# Altium schematic sheet RWcircuit_2.SchDoc
size A4
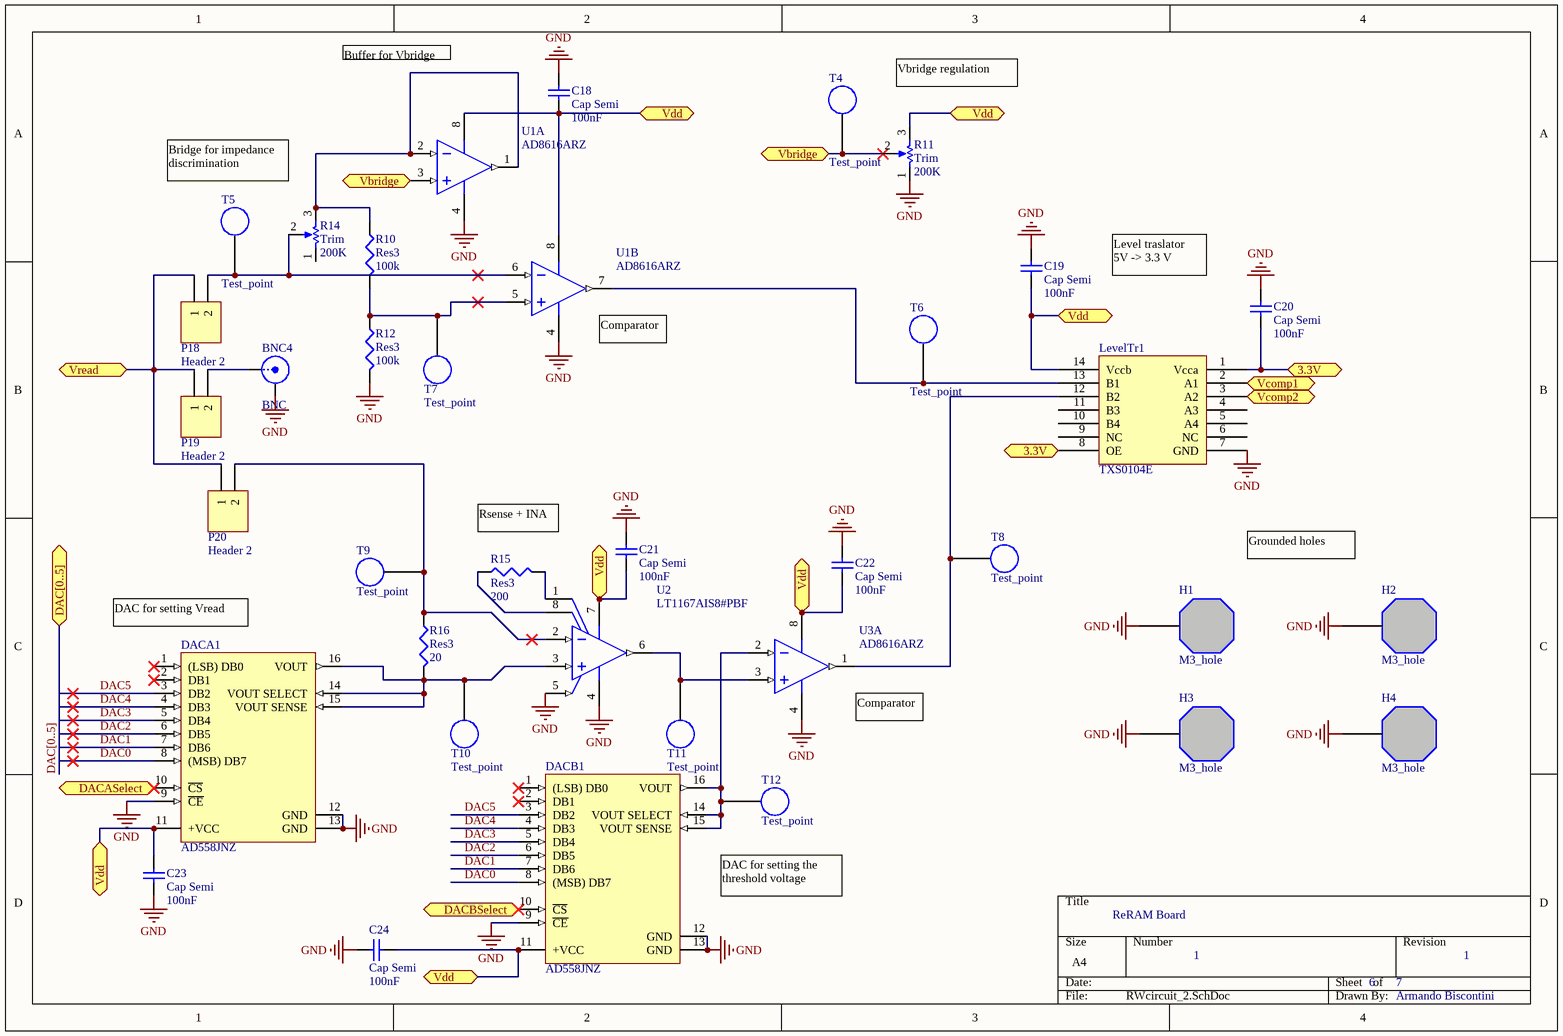
[diagram p0: RWcircuit_2.SchDoc]

## Parts
BNC4  BNC  [BNC_RA CON]
C18  Cap Semi  value 100nF  [C1206]
C19  Cap Semi  value 100nF  [C1206]
C20  Cap Semi  value 100nF  [C1206]
C21  Cap Semi  value 100nF  [C1206]
C22  Cap Semi  value 100nF  [C1206]
C23  Cap Semi  value 100nF  [C1206]
C24  Cap Semi  value 100nF  [C1206]
DACA1  AD558JNZ  [N-16]
DACB1  AD558JNZ  [N-16]
H1  M3_hole  [M3_hole]
H2  M3_hole  [M3_hole]
H3  M3_hole  [M3_hole]
H4  M3_hole  [M3_hole]
LevelTr1  TXS0104E  [SOIC127P600X175-14N]
P18  Header 2  [HDR1X2]
P19  Header 2  [HDR1X2]
P20  Header 2  [HDR1X2]
R10  Res3  value 100k  [J1-0603]
R11  Trim  value 200K  [Trim_Bourns_3266W]
R12  Res3  value 100k  [J1-0603]
R14  Trim  value 200K  [Trim_Bourns_3266W]
R15  Res3  value 200  [J1-0603]
R16  Res3  value 20  [J1-0603]
T4  Test_point  [Test_point_1.32mm]
T5  Test_point  [Test_point_1.32mm]
T6  Test_point  [Test_point_1.32mm]
T7  Test_point  [Test_point_1.32mm]
T8  Test_point  [Test_point_1.32mm]
T9  Test_point  [Test_point_1.32mm]
T10  Test_point  [Test_point_1.32mm]
T11  Test_point  [Test_point_1.32mm]
T12  Test_point  [Test_point_1.32mm]
U1  AD8616ARZ  [ADI-R-8_N]  (parts A,B of 2)
U2  LT1167AIS8#PBF  [LT-S8-8_N]
U3  AD8616ARZ  [ADI-R-8_N]  (part A of 2)

## Ports
3.3V, DAC[0..5], DACASelect, DACBSelect, Vbridge, Vcomp1, Vcomp2, Vdd, Vread

## Nets
GND: BNC4.2(Y) C18.1 C19.1 C20.1 C21.2 C22.1 C23.2 C24.1 DACA1.9(~{CE}) DACA1.12(GND) DACA1.13(GND) DACB1.9(~{CE}) DACB1.12(GND) DACB1.13(GND) H1.1 H2.1 H3.1 H4.1 LevelTr1.7(GND) R11.1(TOP) R12.1 U1.4(-V) U2.4(-VS) U2.5(REF) U3.4(-V)
3.3V: C20.2 LevelTr1.1(Vcca) LevelTr1.8(OE) ; port 3.3V
DAC0: DACA1.8((MSB)_DB7) DACB1.8((MSB)_DB7)
DAC1: DACA1.7(DB6) DACB1.7(DB6)
DAC2: DACA1.6(DB5) DACB1.6(DB5)
DAC3: DACA1.5(DB4) DACB1.5(DB4)
DAC4: DACA1.4(DB3) DACB1.4(DB3)
DAC5: DACA1.3(DB2) DACB1.3(DB2)
DACASelect: DACA1.10(~{CS}) ; port DACASelect
DACBSelect: DACB1.10(~{CS}) ; port DACBSelect
Vbridge: R11.2(TAP) T4.1 U1.3(+IN_A) ; port Vbridge
Vcomp1: LevelTr1.2(A1) ; port Vcomp1
Vcomp2: LevelTr1.3(A2) ; port Vcomp2
Vdd: C18.2 C19.2 C21.1 C22.2 C23.1 C24.2 DACA1.11(+VCC) DACB1.11(+VCC) LevelTr1.14(Vccb) R11.3(BOT) U1.8(+V) U2.7(+VS) U3.8(+V) ; port Vdd
Vread: P18.1 P19.1 P20.1 ; port Vread
NetBNC4_1: BNC4.1(X) P19.2
NetDACA1_14: DACA1.14(VOUT_SELECT) DACA1.15(VOUT_SENSE) DACA1.16(VOUT) R16.1 T10.1 U2.3(+IN)
NetDACB1_14: DACB1.14(VOUT_SELECT) DACB1.15(VOUT_SENSE) DACB1.16(VOUT) T12.1 U3.2(-IN_A)
NetLevelTr1_12: LevelTr1.12(B2) T8.1 U3.1(OUT_A)
NetLevelTr1_13: LevelTr1.13(B1) T6.1 U1.7(OUT_B)
NetP18_2: P18.2 R14.2(TAP) T5.1 U1.6(-IN_B)
NetP20_2: P20.2 R16.2 T9.1 U2.2(-IN)
NetR10_1: R10.1 R12.2 T7.1 U1.5(+IN_B)
NetR10_2: R10.2 R14.3(BOT) U1.1(OUT_A) U1.2(-IN_A)
NetR15_1: R15.1 U2.1(RG)
NetR15_2: R15.2 U2.8(RG)
NetT11_1: T11.1 U2.6(OUTPUT) U3.3(+IN_A)

Not connected (* = marked no-connect by the designer): DACA1 1((LSB)_DB0)* 2(DB1)*; DACB1 1((LSB)_DB0)* 2(DB1)*; LevelTr1 4(A3) 5(A4) 6(NC) 9(NC) 10(B4) 11(B3); R14 1(TOP)

## Buses and harness runs
bus DAC[0..5] = port DAC[0..5]

## Notes on the sheet
- Buffer for Vbridge
- Vbridge regulation
- Bridge for impedance discrimination
- Level traslator
  5V -> 3.3 V
- (near U1) Comparator
- (near R15) Rsense + INA
- Grounded holes
- (near DACA1) DAC for setting Vread
- (near U3) Comparator
- DAC for setting the threshold voltage
- ReRAM Board
- 1
- 6
- 7
- Armando Biscontini

## Library data of the parts
BNC4 = BNC: BNC Elbow Connector; LatestRevisionDate: 17-Jul-2002; LatestRevisionNote: Re-released for DXP Platform.; Publisher: Altium Limited
C18-C24 = Cap Semi: Capacitor (Semiconductor SIM Model); Published: 8-Jun-2000; LatestRevisionDate: 29-May-2009; LatestRevisionNote: IPC-7351 Footprint Added.; PackageReference: C1206; Publisher: Altium Limited; PackageDescription: Chip Capacitor
DACA1 DACB1 = AD558JNZ: Single 8-Bit Low Cost Complete uP-Compatible DACPORT, 0 to +70 degC, N-16, Pb-Free, Tube; Generic Part Number: AD558; Manufacturer: Analog Devices; # DAC Outputs: 1; Max V+: 16.5V; Op Pwr Diss: 375mW; Resolution (Bits): 8; Settling Time: 800ns; Single Supply: Yes; DatasheetVersion: Rev.A; PackageVersion: 070706-A; PackageReference: N-16; PackageDescription: 16-Lead Plastic Dual In-Line Package [PDIP] Narrow Body; Supplier 1: Digi-Key; Supplier Part Number 1: AD558JNZ-ND; Supplier 2: Farnell; Supplier Part Number 2: 1079362; Supplier 3: Farnell; Supplier Part Number 3: 1523778; Supplier 4: Newark; Supplier Part Number 4: 59K4249; Supplier 5: Mouser; Supplier Part Number 5: 584-AD558JNZ; Packing: Tube; RoHS: Y; Mounting Technology: Through Hole; Code_JEDEC: MS-001; PartNumber: AD558JNZ; ComponentLink1Description: Manufacturer URL; ComponentLink1URL: http://www.analog.com/en/index.html; ComponentLink2Description: Datasheet; ComponentLink2URL: http://www.analog.com/static/imported-files/data_sheets/AD558.pdf; ComponentLink3Description: Package Specification; ComponentLink3URL: http://www.analog.com/static/imported-files/packages/44768431550332N_16.pdf; ComponentLink4Description: Product URL; ComponentLink4URL: http://www.analog.com/en/digital-to-analog-converters/da-converters/ad558/products/product.html
H1-H4 = M3_hole: M3 hole
LevelTr1 = TXS0104E: Texas Instruments TXS0104E
P18-P20 = Header 2: Header, 2-Pin; LatestRevisionDate: 17-Jul-2002; LatestRevisionNote: Re-released for DXP Platform.; Publisher: Altium Limited
R10 R12 R15 R16 = Res3: Resistor; Published: 8-Jun-2000; LatestRevisionDate: 29-May-2009; LatestRevisionNote: IPC-7351 Footprint Added.; PackageReference: J1-0603; Publisher: Altium Limited; PackageDescription: Chip Resistor
R11 R14 = Trim_Bourns_3266W: Trimmer Bourns 3266W; Sim Note: Enter the Resistance value and the set point into parameter fields.; Set Position: 0.5; Published: 8-Jun-2000; LatestRevisionDate: 17-Jul-2002; LatestRevisionNote: Re-released for DXP Platform.; PackageReference: VR5; Publisher: Altium Limited; PackageDescription: Variable Resistor, Thru-Hole; 3 Leads
T4-T12 = Test_point_1.32mm: Test point 1.32mm
U1 U3 = AD8616ARZ: Double Channel Wide Bandwidth Operational Amplifier, 24 MHz BW, 12 V/us SR, Industrial, 8-pin SOIC (R-8), Tube; Generic Part Number: AD8616; Manufacturer: Analog Devices; Amplifiers Per Package: 2; Input Bias Current: 200fA; Input Offset Voltage: 23uV; Iq/Amp: 2mA; Slew Rate: 12V/us; Small Signal Bandwidth: 24MHz; V Span Max: 6V; V Span Min: 2.7V; DatasheetVersion: Rev. E; PackageVersion: 060506-A; PackageReference: R-8; PackageDescription: 8-Pin Standard Small Outline Package, Body 3.9 x 4.9 mm, Pitch 1.27 mm; Supplier 1: Digi-Key; Supplier Part Number 1: AD8616ARZ-ND; Supplier 2: Farnell; Supplier Part Number 2: 1581952; Supplier 3: Newark; Supplier Part Number 3: 19M0977; Mounting Technology: Surface Mount; Code_JEDEC: MS-012-AA; PartNumber: AD8616ARZ; ComponentLink1Description: Manufacturer URL; ComponentLink1URL: http://www.analog.com/en/index.html; ComponentLink2Description: Datasheet; ComponentLink2URL: http://www.analog.com/static/imported-files/data_sheets/AD8615_8616_8618.pdf; ComponentLink3Description: Package Specification; ComponentLink3URL: http://www.analog.com/static/imported-files/packages/PKG_PDF/SOIC_Narrow%20(R)/R_8.pdf
U2 = LT1167AIS8#PBF: Single Channel, Precision Operational Amplifier, Low Bias Current IA, 1 MHz Typical GBW, 1.2 V/us Typical SR, 4.6 to 40 V, 8-Pin SOIC (S8-8), Industrial, Pb-Free; Linear Technology Part Number: LT1167; Manufacturer: Linear Technology; Channels (#): 1; Is (mA) Typical: 0.9; SR (V/us) Typical: 1.2; Vos (mV) Typical: 0.015; Vs Max (V): 40; Vs Min (V): 4.6; DatasheetVersion: Rev. C; PackageVersion: Rev G; PackageReference: LT-S8-8; PackageDescription: 8-Pin Plastic Small Outline, Body 4.9 x 3.9 mm, Pitch 1.27 mm; Supplier 1: Digi-Key; Supplier Part Number 1: LT1167AIS8#PBF-ND; Supplier 2: Farnell; Supplier Part Number 2: 1663385; Supplier 3: Newark; Supplier Part Number 3: 57M2299; GBW (MHz) Typical: 1; RoHS: Pb-Free; Type: IA; Mounting Technology: Surface Mount; PartNumber: LT1167AIS8#PBF; ComponentLink1Description: Manufacturer URL; ComponentLink1URL: http://www.linear.com/; ComponentLink2Description: Datasheet; ComponentLink2URL: http://cds.linear.com/docs/en/datasheet/1167fc.pdf; ComponentLink3Description: Package Specification; ComponentLink3URL: http://cds.linear.com/docs/en/packaging/05081610_G_SO8.pdf